# EAGLE design gr10-1 (EAGLE 6.1)
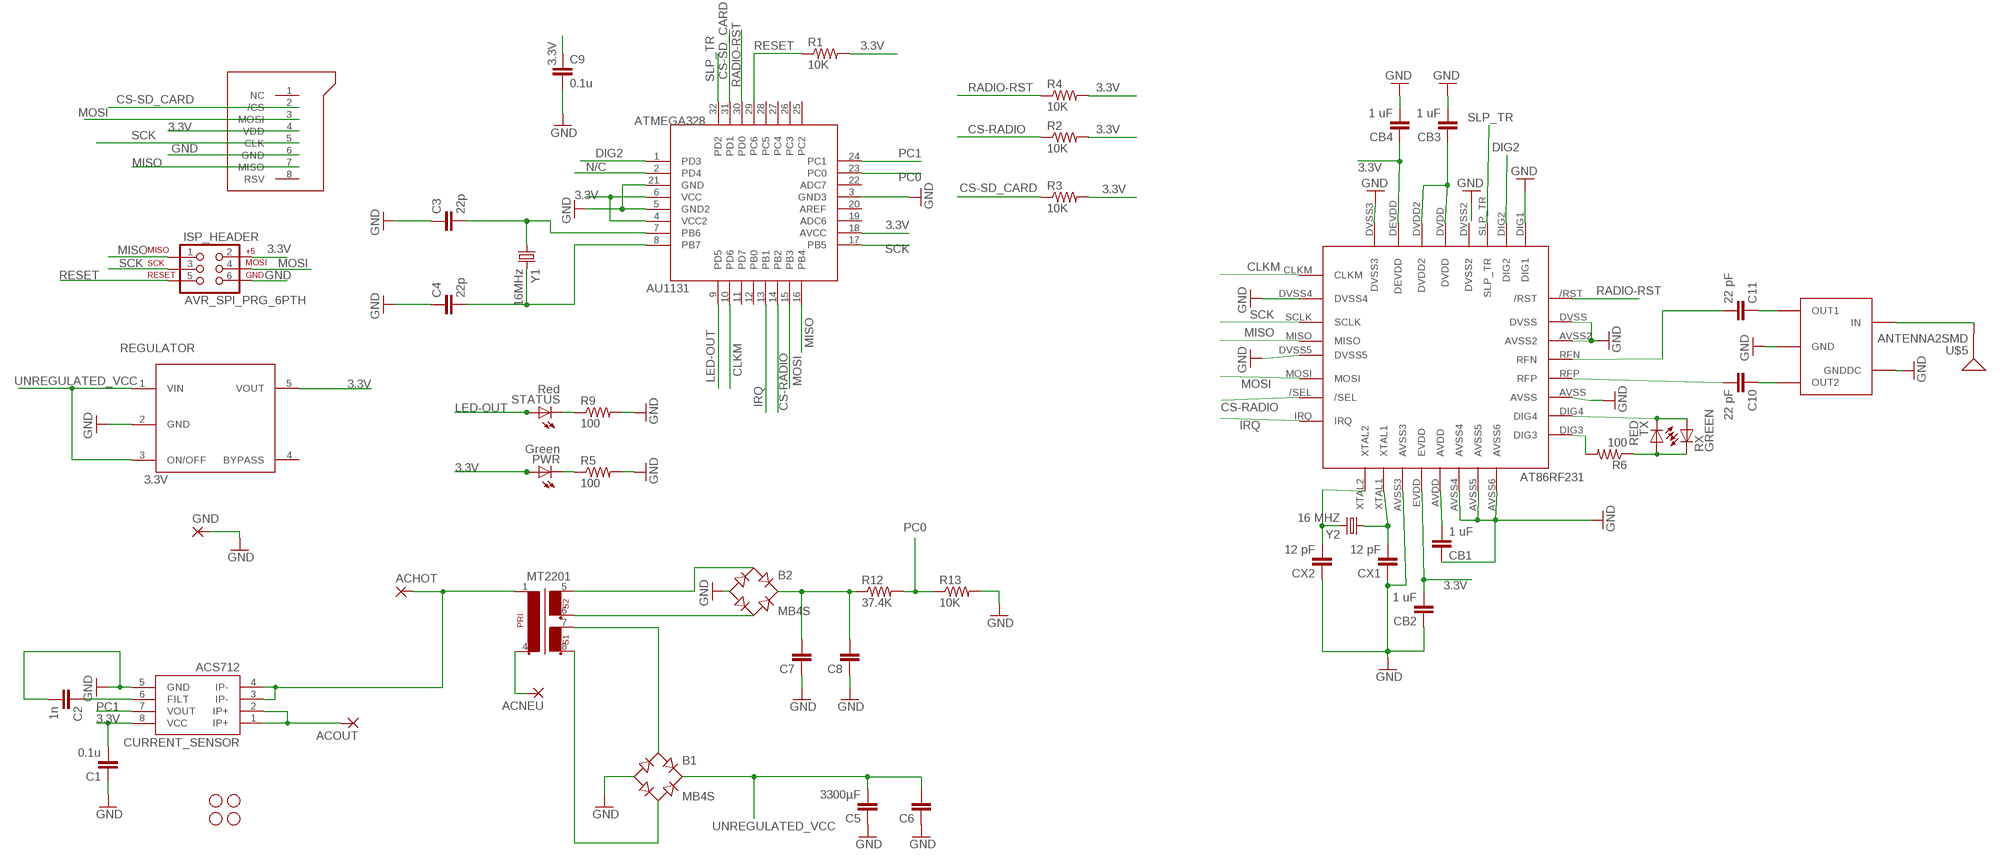
[diagram p0: schematic, sheet 1]

## Parts
3.3V_REGULATOR  REG3.3V  [SOT23-5]
ACHOT  3,81/1,4  [3,81/1,4]
ACNEU  3,81/1,4  [3,81/1,4]
ACOUT  3,81/1,4  [3,81/1,4]
B1  MB4S  [SOIC-4]
B2  MB4S  [SOIC-4]
C1  0.1u  CAP0603-CAP  [0603-CAP]
C2  1n  CAP0603-CAP  [0603-CAP]
C3  22p  CAP0603-CAP  [0603-CAP]
C4  22p  CAP0603-CAP  [0603-CAP]
C5  3300µF  CAPPTH1  [CAP-PTH-5MM]
C6  CAPPTH1  [CAP-PTH-5MM]
C7  CAPPTH1  [CAP-PTH-5MM]
C8  CAPPTH1  [CAP-PTH-5MM]
C9  0.1u  CAP0603-CAP  [0603-CAP]
C10  22 pF  CAP0603-CAP  [0603-CAP]
C11  22 pF  CAP0603-CAP  [0603-CAP]
CB1  1 uF  CAP0603-CAP  [0603-CAP]
CB2  1 uF  CAP0603-CAP  [0603-CAP]
CB3  1 uF  CAP0603-CAP  [0603-CAP]
CB4  1 uF  CAP0603-CAP  [0603-CAP]
CURRENT_SENSOR  ACS712  [SO08]
CX1  12 pF  CAP0603-CAP  [0603-CAP]
CX2  12 pF  CAP0603-CAP  [0603-CAP]
GND  3,81/1,4  [3,81/1,4]
ISP_HEADER  AVR_SPI_PRG_6PTH  [2X3]
JP1  STAND-OFF  [STAND-OFF]
JP2  STAND-OFF  [STAND-OFF]
JP3  STAND-OFF  [STAND-OFF]
JP4  STAND-OFF  [STAND-OFF]
MT2201  EI38-2  [EI38-2]
PWR  Green  LED0603  [LED-0603]
R1  10K  RESISTOR0603-RES  [0603-RES]
R2  10K  RESISTOR0603-RES  [0603-RES]
R3  10K  RESISTOR0603-RES  [0603-RES]
R4  10K  RESISTOR0603-RES  [0603-RES]
R5  100  RESISTOR0603-RES  [0603-RES]
R6  100  RESISTOR0603-RES  [0603-RES]
R9  100  RESISTOR0603-RES  [0603-RES]
R12  37.4K  RESISTOR0603-RES  [0603-RES]
R13  10K  RESISTOR0603-RES  [0603-RES]
RX  GREEN  LED0603  [LED-0603]
STATUS  Red  LED0603  [LED-0603]
TX  RED  LED0603  [LED-0603]
U$1  MICROSD  [MICRO-SD-SOCKET-PP]
U$2  ATMEGA32832A  [TQFP32-08]
U$3  AT86RF231(RADIO)AT86RF231  [32QN2(RADIO)]
U$4  WE-BAL  [WE-BAL]
U$5  ANTENNA2SMD  [ANTENNA-CHIP2]
Y1  16MHz  CRYSTALSMD  [HC49UP]
Y2  16 MHZ  CRYSTALSMD  [HC49UP]

## Nets
3.3V: 3.3V_REGULATOR.5(VOUT) C1.2 C9.1 CB2.2 CB4.1 CURRENT_SENSOR.8(VCC) ISP_HEADER.2 PWR.A R1.2 R2.2 R3.2 R4.2 U$1.4(VDD) U$2.4(VCC2) U$2.6(VCC) U$2.18(AVCC) U$3.DEVDD U$3.EVDD
CLKM: U$2.10(PD6) U$3.CLKM
CS-RADIO: R2.1 U$2.14(PB2) U$3./SEL
CS-SD_CARD: R3.1 U$1.2(/CS) U$2.31(PD1)
DIG2: U$2.1(PD3) U$3.DIG2
GND: 3.3V_REGULATOR.2(GND) B1.- B2.- C1.1 C2.2 C3.1 C4.1 C5.1 C6.1 C7.1 C8.1 C9.2 CB1.1 CB2.1 CB3.2 CB4.2 CURRENT_SENSOR.5(GND) CX1.1 CX2.1 GND.1(P) ISP_HEADER.6 R5.2 R9.2 R13.2 U$1.6(GND) U$2.3(GND3) U$2.5(GND2) U$2.21(GND) U$3.AVSS U$3.AVSS2 U$3.AVSS3 U$3.AVSS4 U$3.AVSS5 U$3.AVSS6 U$3.DIG1 U$3.DVSS U$3.DVSS3 U$3.DVSS4 U$3.DVSS5 U$4.GND U$4.GNDDC
IRQ: U$2.13(PB1) U$3.IRQ
LED-OUT: STATUS.A U$2.9(PD5)
MISO: ISP_HEADER.1 U$1.7(MISO) U$2.16(PB4) U$3.MISO
MOSI: ISP_HEADER.4 U$1.3(MOSI) U$2.15(PB3) U$3.MOSI
N$1: ACHOT.1(P) CURRENT_SENSOR.3(IP-) CURRENT_SENSOR.4(IP-) MT2201.1
N$2: ACNEU.1(P) MT2201.4
N$3: B1.~2(AC2) MT2201.8
N$4: B2.~1(AC1) MT2201.5
N$5: B2.~2(AC2) MT2201.6
N$6: B2.+ C7.2 C8.2 R12.1
N$7: PWR.C R5.1
N$8: ACOUT.1(P) CURRENT_SENSOR.1(IP+) CURRENT_SENSOR.2(IP+)
N$9: CB3.1 U$3.DVDD U$3.DVDD2
N$10: CB1.2 U$3.AVDD
N$11: CX1.2 U$3.XTAL1 Y2.1
N$12: CX2.2 U$3.XTAL2 Y2.2
N$13: RX.A TX.C U$3.DIG4
N$14: R6.1 RX.C TX.A
N$15: R6.2 U$3.DIG3
N$16: C10.1 U$4.OUT2
N$17: C11.1 U$4.OUT1
N$18: C11.2 U$3.RFN
N$19: C10.2 U$3.RFP
N$20: U$4.IN U$5.FEED(SIGNAL)
N$23: B1.~1(AC1) MT2201.7
N$28: C2.1 CURRENT_SENSOR.6(FILT)
N$30: R9.1 STATUS.C
N/C: U$2.2(PD4)
PC0: R12.2 R13.1 U$2.23(PC0)
PC1: CURRENT_SENSOR.7(VOUT) U$2.24(PC1)
RADIO-RST: R4.1 U$2.30(PD0) U$3./RST
RESET: ISP_HEADER.5 R1.1 U$2.29(PC6)
SCK: ISP_HEADER.3 U$1.5(CLK) U$2.17(PB5) U$3.SCLK
SLP_TR: U$2.32(PD2) U$3.SLP_TR
UNREGULATED_VCC: 3.3V_REGULATOR.1(VIN) 3.3V_REGULATOR.3(ON/OFF) B1.+ C5.2 C6.2
XTAL1: C3.2 U$2.7(PB6) Y1.1
XTAL2: C4.2 U$2.8(PB7) Y1.2
Unconnected: 3.3V_REGULATOR.4(BYPASS) U$1.1(NC) U$1.8(RSV) U$2.11(PD7) U$2.12(PB0) U$2.19(ADC6) U$2.20(AREF) U$2.22(ADC7) U$2.25(PC2) U$2.26(PC3) U$2.27(PC4) U$2.28(PC5) U$3.DVSS2

## Library data of the parts
3.3V_REGULATOR = group10:REG3.3V
ACHOT ACNEU ACOUT GND = wirepad:3,81/1,4: THROUGH-HOLE PAD
B1 B2 = rectifier:MB*S: Bridge Rectifier Source: http://www.fairchildsemi.com/ds/MB/MB6S.pdf
C1-C11 CB1-CB4 CX1 CX2 = SparkFun:CAP: Capacitor Standard 0603 ceramic capacitor, and 0.1" leaded capacitor.
CURRENT_SENSOR = group10:ACS712
ISP_HEADER = SparkFun:AVR_SPI_PRG_6: AVR ISP 6 Pin This is the reduced ISP connector for AVR programming. Common on Arduino. This footprint will take up less PCB space and can be used with a 10-pin to 6-pin adapter such as SKU: BOB-08508
JP1-JP4 = SparkFun:STAND-OFF: Stand Off This is the mechanical footprint for a #4 phillips button head screw. Use the keepout ring to avoid running the screw head into surrounding components. SKU : PRT-00447
MT2201 = group10:EI38-2: TRANSFORMER 1 primary winding, 2 secondary windings ERA
PWR RX STATUS TX = SparkFun:LED: LEDs Standard schematic elements and footprints for 5mm, 3mm, 1206, and 0603 sized LEDs. 5mm - Spark Fun Electronics SKU : COM-00529 (and others)
R1-R6 R9 R12 R13 = SparkFun:RESISTOR: Resistor Basic schematic elements and footprints for 0603, 1206, and PTH resistors.
U$1 = group10:MICROSD
U$2 = group10:ATMEGA328
U$3 = group10:AT86RF231(RADIO)
U$4 = group10:WE-BAL
U$5 = SparkFun:ANTENNA2: Antenna Single endded antenna. Common with smaller chip antennas. CHIP4 package is the GPS Chip Antenna SKU: GPS-08418. CHIP5 package is 2.4GHz chip antenna SKU: WRL-00144.
Y1 Y2 = group10:CRYSTAL: Crystals Various standard crystals. Proven footprints. Spark Fun Electronics SKU : COM-00534

## Net classes
1 Mini: width 0.25 mm

## Board
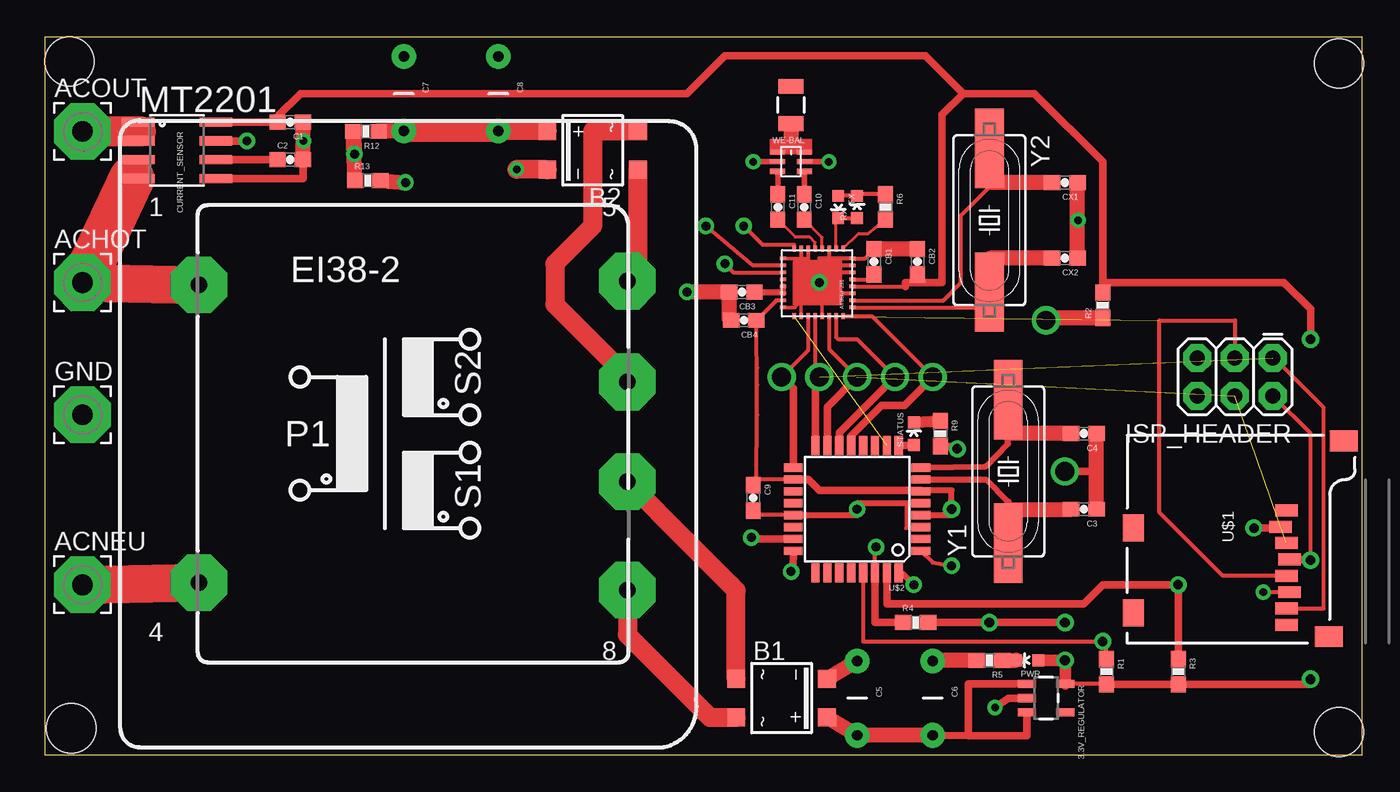
[diagram p1: board, top side]
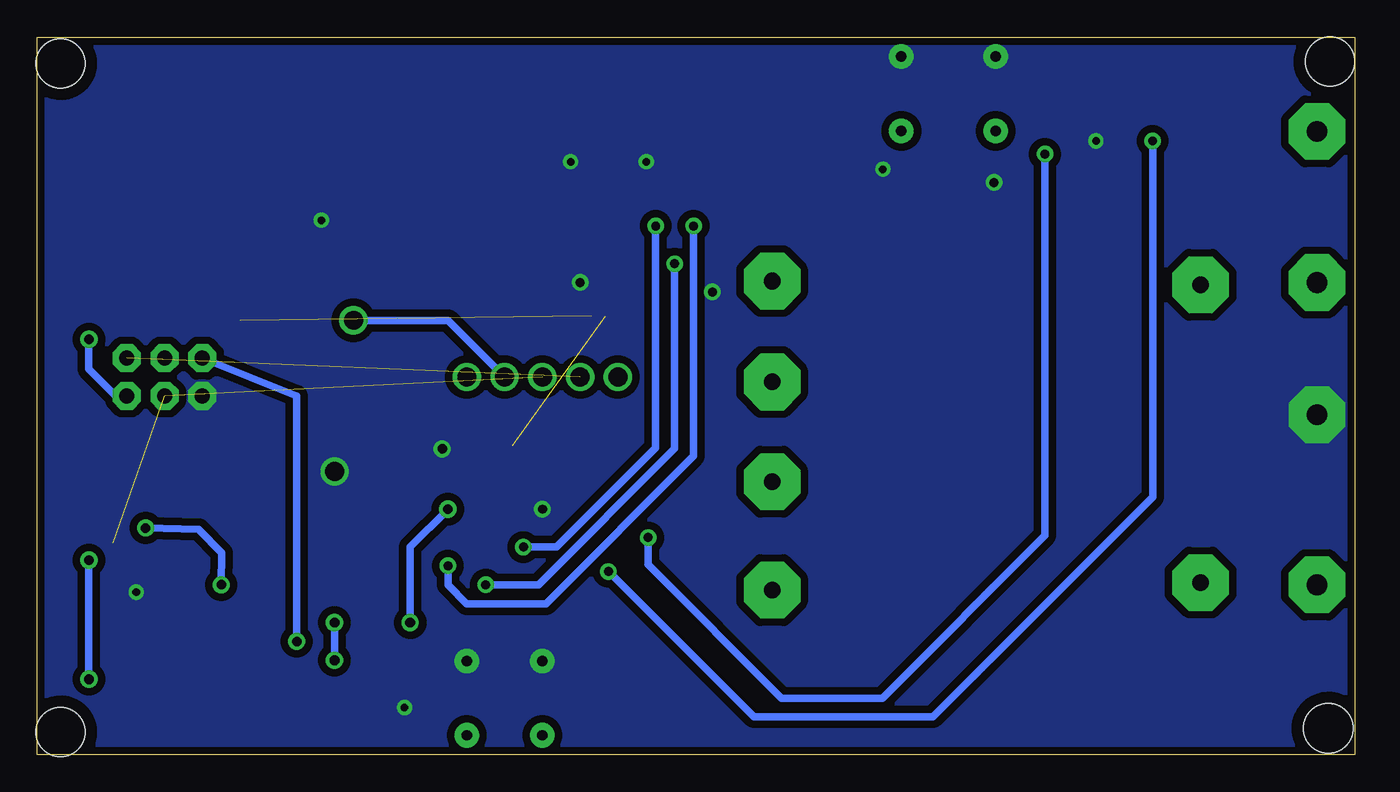
[diagram p2: board, bottom side, seen from below]

Size 88.57 x 48.25 mm. Coordinates in mm from the lower left corner, seen from the top.
Outline: 0,0 88.57,0 88.57,48.25 0,48.25 0,0
Copper layers (1*16): Top 0.035mm / dielectric 1.5mm / Bottom 0.035mm
Design rules: minimum track width 8mil, minimum drill 20mil, track to track 15mil, track to pad 15mil, pad to pad 15mil, via to via 15mil, smd to smd 0mil, copper to edge 10mil, drill to drill 8mil, minimum pad ring 12mil, minimum via ring 10mil, stop-mask expansion 4mil, vias tented up to drill 25mil, thermal gap 10mil

### Footprints (pad centres in the part's own frame; a part is rotated, then mirrored left to right if it is on the bottom)
SOT23-5 = smd 0.55 x 1.2: 1 -0.95,-1.3; 2 0,-1.3; 3 0.95,-1.3; 4 0.95,1.3; 5 -0.95,1.3
3,81/1,4 = drill 1.397 pad 3.81 octagon: 1 0,0
SOIC-4 = smd 1.2 x 1.2: + 1.3,3.05; - -1.3,3.05; ~1 -1.3,-3.05; ~2 1.3,-3.05
0603-CAP = smd 1.1 x 1: 1 -0.85,0; 2 0.85,0
CAP-PTH-5MM = drill 0.7 pad 1.651: 1 -2.5,0; 2 2.5,0
SO08 = smd 0.61 x 2.21: 1 -1.905,-2.616; 2 -0.635,-2.616; 3 0.635,-2.616; 4 1.905,-2.616; 5 1.905,2.616; 6 0.635,2.616; 7 -0.635,2.616; 8 -1.905,2.616
2X3 = drill 1.016 pad 1.88 octagon: 1 0,0; 2 0,2.54; 3 2.54,0; 4 2.54,2.54; 5 5.08,0; 6 5.08,2.54
STAND-OFF = hole 3.302: 0,0
EI38-2 = drill 1.118 pad 3.81 octagon: 1 -12.497,10.008; 4 -12.497,-10.008; 5 16.307,10.262; 6 16.307,3.48; 7 16.307,-3.226; 8 16.307,-10.516
LED-0603 = smd 0.8 x 0.8: A 0,-0.75; C 0,0.75
0603-RES = smd 1.1 x 1: 1 -0.85,0; 2 0.85,0
MICRO-SD-SOCKET-PP = smd 0.8 x 1.5: 1 -8.94,10.7; 2 -7.84,10.3; 3 -6.74,10.7; 4 -5.64,10.9; 5 -4.54,10.7; 6 -3.44,10.9; 7 -2.34,10.7; 8 -1.24,10.7 | smd 1.8 x 1.4: CD1 -2.05,0.4; CD2 -7.75,0.4 | smd 1.4 x 1.9: GND1 -13.6,14.55; GND3 -0.45,13.55
TQFP32-08 = smd 1.27 x 0.559: 1 -4.293,2.8; 2 -4.293,2; 3 -4.293,1.2; 4 -4.293,0.4; 5 -4.293,-0.4; 6 -4.293,-1.2; 7 -4.293,-2; 8 -4.293,-2.8; 17 4.293,-2.8; 18 4.293,-2; 19 4.293,-1.2; 20 4.293,-0.4; 21 4.293,0.4; 22 4.293,1.2; 23 4.293,2; 24 4.293,2.8 | smd 0.559 x 1.27: 9 -2.8,-4.293; 10 -2,-4.293; 11 -1.2,-4.293; 12 -0.4,-4.293; 13 0.4,-4.293; 14 1.2,-4.293; 15 2,-4.293; 16 2.8,-4.293; 25 2.8,4.293; 26 2,4.293; 27 1.2,4.293; 28 0.4,4.293; 29 -0.4,4.293; 30 -1.2,4.293; 31 -2,4.293; 32 -2.8,4.293
32QN2(RADIO) = smd 0.4 x 0.23: /RST -2.29,-1.7; /SEL 2.26,1.13; AVSS -2.29,0.65; AVSS2 -2.29,-0.76; CLKM 2.26,-1.69; DIG3 -2.29,1.59; DIG4 -2.29,1.12; DVSS -2.29,-1.23; DVSS4 2.26,-1.22; DVSS5 2.26,0.19; IRQ 2.26,1.6; MISO 2.26,-0.28; MOSI 2.26,0.66; RFN -2.29,-0.29; RFP -2.29,0.18; SCLK 2.26,-0.75 | smd 0.23 x 0.4: AVDD -0.21,2.23; AVSS3 0.73,2.23; AVSS4 -0.68,2.23; AVSS5 -1.15,2.23; AVSS6 -1.62,2.23; DEVDD 1.2,-2.44; DIG1 -1.62,-2.44; DIG2 -1.15,-2.44; DVDD 0.26,-2.44; DVDD2 0.73,-2.44; DVSS2 -0.21,-2.44; DVSS3 1.67,-2.44; EVDD 0.26,2.23; SLP_TR -0.68,-2.44; XTAL1 1.2,2.23; XTAL2 1.67,2.23
WE-BAL = smd 1 x 0.35: GND 0.9,0; GNDDC -0.9,0; IN -0.9,0.65; NC 0.9,0.65; OUT1 -0.9,-0.65; OUT2 0.9,-0.65
ANTENNA-CHIP2 = smd 1.7 x 1: FEED 0,1.25; P$2 0,-1.25
HC49UP = smd 5.334 x 1.93: 1 -4.826,0; 2 4.826,0

### Placement (x,y rotation side)
3.3V_REGULATOR  67.31,3.81 270 top
ACHOT  2.54,31.75 0 top
ACNEU  2.54,11.43 0 top
ACOUT  2.54,41.91 0 top
B1  49.53,3.81 270 top
B2  36.83,40.64 90 top
C1  16.51,42.55 180 top
C2  16.51,40.01 0 top
C3  69.85,16.51 180 top
C4  69.85,21.59 180 top
C5  54.61,3.81 270 top
C6  59.69,3.81 270 top
C7  24.13,44.45 270 top
C8  30.48,44.45 270 top
C9  47.62,17.27 270 top
C10  51.05,36.83 270 top
C11  49.28,36.83 270 top
CB1  55.75,33.15 270 top
CB2  58.67,33.15 270 top
CB3  46.86,31.11 180 top
CB4  46.99,29.21 180 top
CURRENT_SENSOR  8.89,40.64 270 top
CX1  68.58,38.48 180 top
CX2  68.58,33.4 180 top
GND  2.54,22.86 0 top
ISP_HEADER  82.55,26.67 180 top
JP1  1.78,1.78 0 top
JP2  87,46.48 0 top
JP3  1.65,46.61 0 top
JP4  87,1.52 0 top
MT2201  22.86,21.59 0 top
PWR  66.04,6.35 90 top
R1  71.37,5.59 270 top
R2  71.12,30.23 90 top
R3  76.2,5.59 270 top
R4  58.55,8.89 0 top
R5  63.5,6.35 180 top
R6  56.52,36.83 270 top
R9  60.2,21.59 270 top
R12  21.59,41.91 180 top
R13  21.72,38.61 0 top
RX  54.61,36.83 0 top
STATUS  58.42,21.59 0 top
TX  53.34,36.83 180 top
U$1  72.77,7.49 270 top
U$2  54.61,16.51 180 top
U$3  52.07,31.75 270 top
U$4  50.16,39.88 0 top
U$5  50.16,43.69 180 top
Y1  64.77,19.05 90 top
Y2  63.5,35.94 270 top

### Tracks (layer width: path | path; a pad name or v marks a point on that pad's centre or on a via)
3.3V  (via drill 0.66)
  Top 0.254: v85.09,13.08 85.09,21.59 ISP_HEADER.2 | U$3.DEVDD 49.18,30.55 CB4.1 47.84,27.52 47.88,26.04 47.88,24.89 47.88,22.86 47.84,18.51 47.24,18.51 | U$3.EVDD 57.87,31.49 CB2.2 | U$2.18 47.24,18.51 | 47.24,18.51 C9.1 | R1.2 71.37,4.76 3.3V_REGULATOR.5
  Top 0.406: U$2.4 60.96,16.11 v60.96,16.51 60.96,17.78 58.9,17.78 U$2.6
  Top 0.508: CURRENT_SENSOR.8 C1.2 15.66,42.92 17.19,44.45 43.18,44.45 45.72,46.99 57.15,46.99 59.2,46.99 61.74,44.45 | R1.2 R3.2 85.09,4.74 v85.09,5.08 | 57.87,31.49 57.87,31.75 60.33,31.75 60.33,43.03 61.74,44.45 | 61.74,44.45 66.54,44.45 71.12,39.87 71.12,31.88 | 71.12,31.88 71.12,31.75 | 71.12,31.75 71.12,31.88 | 71.12,31.88 R2.2 | R4.2 62.23,8.89 v63.5,8.89 v68.58,8.89 | U$1.4 85.09,13.13 v85.09,13.08 | 58.9,17.78 52.07,17.78 51.34,18.51 U$2.18 | 71.12,31.75 83.29,31.75 85.09,29.95 v85.09,27.94
  Top 0.762: 3.3V_REGULATOR.5 68.61,6.35 v68.58,6.35 PWR.A
  Bottom 0.508: v68.58,6.35 v68.58,8.89 | v85.09,5.08 v85.09,13.08 | v60.96,16.51 63.5,13.97 v63.5,8.89 | v85.09,27.94 85.09,25.93 83.29,24.13 ISP_HEADER.2
CLKM  (1 unrouted)
CS-RADIO  (via drill 1.27)
  Top 0.254: U$3./SEL 53.2,28.08 53.34,27.94 54.61,27.94 v57.15,25.4
  Top 0.508: U$2.14 53.41,21.66 v57.15,25.4
  Top 1.016: R2.1 67.48,29.38 v67.31,29.21
  Bottom 0.508: v67.31,29.21 60.96,29.21 v57.15,25.4
CS-SD_CARD  (via drill 0.64)
  Top 0.508: U$2.31 56.61,10.16 69.85,10.16 71.12,11.43 v76.2,11.43 R3.1 | U$1.2 83.07,15.24 82.55,15.24 v81.28,15.24
  Bottom 0.508: v76.2,11.43 76.15,13.59 77.72,15.16 v81.28,15.24
DIG2  (via drill 0.6)
  Top 0.254: U$2.1 59.69,12.92 v60.96,12.7 | U$3.DIG2 47.62,32.9 v44.45,35.56
  Bottom 0.508: v60.96,12.7 60.96,11.43 59.69,10.16 54.37,10.16 44.45,20.08 v44.45,35.56
GND  (via drill 0.51, 0.6, 0.64, 1.27)
  Top 0.2: CX1.1 69.47,38.44 v69.47,35.94
  Top 0.25: U$3.DVSS5 52.27,31.67 52.27,31.75 v52.07,31.75 | U$3.DIG1 51.21,33.37 51.21,33.35 v52.07,31.75 | U$3.DVSS4 50.85,29.54 50.85,30.53 | U$3.DVSS3 50.42,30.08 50.42,30.1 50.85,30.53 | 50.85,30.53 v52.07,31.75
  Top 0.254: C4.1 70.61,21.59 | U$4.GNDDC 48.9,39.88 | U$1.6 v81.92,10.93 | CB1.1 55.13,33.37 U$3.AVSS6 52.07,33.37 v52.07,31.75 | U$2.21 47.24,16.11 C9.2 | U$3.DVSS 50.84,31.75 v52.07,31.75 | U$3.AVSS2 51.31,31.75 v52.07,31.75 | U$3.AVSS 52.72,31.75 v52.07,31.75 | U$3.AVSS5 52.07,32.9 v52.07,31.75 | U$3.AVSS4 52.07,32.43 v52.07,31.75 | U$3.AVSS3 52.07,31.02 v52.07,31.75 | U$2.5 57.91,16.91 57.91,15.24 58.42,15.24 58.42,15.31 U$2.3 | C6.1 59.73,6.31 59.73,6.35 | C1.1 17.4,42.55 v17.4,41.27
  Top 0.356: 48.9,39.88 v47.62,39.88 | U$4.GND v52.7,39.88
  Top 0.406: U$2.21 54.61,16.11 v54.61,16.51 54.61,16.91 U$2.5 | C3.1 70.74,16.55
  Top 0.508: CURRENT_SENSOR.5 17.36,38.73 C2.2 | 3.3V_REGULATOR.2 64.77,3.81 v63.88,3.17 | v61.34,20.57 61.17,20.74 R9.2 | 70.61,21.59 70.74,21.46 70.74,19.05 70.61,19.05 v68.58,19.05
  Top 1: CB3.2 v43.18,31.11
  Top 1.016: R5.2 59.73,6.35 | C3.1 C4.1 | C2.2 C1.1 | B1.- C5.1 | CX2.1 CX1.1 | CB3.2 46.01,29.34 CB4.2 | CB2.1 CB1.1 | R13.2 v24.26,38.48
  Top 1.27: B2.- v31.72,39.37
  pour Bottom (isolate 0.508, no thermals): 88.9,48.26 0,48.26 0,0 88.9,0
IRQ  (via drill 1.27)
  Top 0.254: U$3.IRQ 55.6,29.49 v59.69,25.4
  Top 0.508: U$2.13 54.21,21.44 56.26,23.5 57.78,23.5 v59.69,25.4
LED-OUT
  Top 0.508: STATUS.A 58.38,20.8 U$2.9
MISO  (via drill 1.27)  (1 unrouted)
  Top 0.254: U$1.7 85.98,9.83 85.98,23.34 82.64,26.67 ISP_HEADER.1 | U$3.MISO 51.79,25.68 v52.07,25.4
  Top 0.508: U$2.16 51.81,25.14 v52.07,25.4
MOSI  (via drill 1.27)  (2 unrouted)
  Top 0.254: U$3.MOSI 52.73,27.28 v54.61,25.4
  Top 0.508: U$2.15 52.61,23.4 v54.61,25.4
N$1
  Top 0.254: 5.84,38.73 CURRENT_SENSOR.4 CURRENT_SENSOR.3
  Top 2.54: ACHOT.1 MT2201.1
  Top 3.048: 5.84,38.73 ACHOT.1
N$2
  Top 2.54: ACNEU.1 MT2201.4
N$3
  Top 1.27: MT2201.8 39.17,8.06 44.72,2.51 B1.~2
N$4
  Top 1.27: MT2201.5 39.88,31.85 B2.~1
N$5
  Top 1.27: 39.17,25.4 MT2201.6 39.17,25.4 | B2.~2 36.83,41.94 36.83,35.56 34.29,33.02 34.29,30.28 39.17,25.4
N$6
  Top 1.016: R12.1 22.44,41.95 C7.2
  Top 1.27: B2.+ C8.2
  Top 1.524: C8.2 C7.2
N$7
  Top 1.016: R5.1 PWR.C
N$8
  Top 0.254: 6.48,41.91 CURRENT_SENSOR.1 CURRENT_SENSOR.2
  Top 2.032: 6.48,41.91 ACOUT.1
N$9
  Top 0.406: U$3.DVDD U$3.DVDD2 49.53,31.11 CB3.1
N$10
  Top 0.254: U$3.AVDD 55.42,31.96 CB1.2
N$11
  Top 0.254: Y2.1 63.5,38.48 63.5,38.17 61.59,36.27 61.59,31.75 60.4,30.55 U$3.XTAL1
  Top 1.016: CX1.2 63.5,38.48 63.5,39.37 Y2.1
N$12
  Top 0.254: U$3.XTAL2 63.5,30.08 63.65,30.08
  Top 0.508: Y2.2 63.5,30.08
  Top 1.016: CX2.2 63.56,33.4 Y2.2
N$13
  Top 0.2: U$3.DIG4 53.19,35.93
  Top 0.254: TX.C RX.A
  Top 0.406: 53.19,35.93 TX.C
N$14
  Top 0.254: TX.A RX.C 54.71,37.68 R6.1
N$15
  Top 0.2: U$3.DIG3 54.7,35.05 55.37,35.05 R6.2
N$16
  Top 0.254: 51.05,39.22 U$4.OUT2
  Top 0.381: C10.1 51.05,39.22
N$17
  Top 0.254: 49.28,39.22 U$4.OUT1
  Top 0.381: C11.1 49.28,39.22
N$18
  Top 0.2: U$3.RFN 51.78,34.45 51.44,34.8 50.46,34.8 C11.2
N$19
  Top 0.2: U$3.RFP 52.25,34.78 C10.2
N$20
  Top 0.254: 50.16,41.43 U$4.IN
  Top 1.016: U$5.FEED 50.16,41.43
N$23
  Top 1.27: B1.~1 46.48,11.05 46.1,11.43 43.18,14.35 MT2201.7
N$28
  Top 0.508: C2.1 CURRENT_SENSOR.6
N$30
  Top 0.762: R9.1 STATUS.C
PC0  (via drill 0.6)
  Top 0.508: U$2.23 47.5,14.51 v47.5,14.61
  Top 1.016: R13.1 R12.2 v20.83,40.39
  Bottom 0.508: v47.5,14.61 47.5,12.79 38.52,3.81 31.75,3.81 20.83,14.73 v20.83,40.39
PC1  (via drill 0.6)
  Top 0.254: 50.16,12.44 v50.16,12.32
  Top 0.508: CURRENT_SENSOR.7 v13.59,41.27 | U$2.24 50.29,12.45 50.16,12.45 50.16,12.44
  Bottom 0.508: v50.16,12.32 40.39,2.54 35.56,2.54 28.37,2.54 13.59,17.32 v13.59,41.27
RADIO-RST  (via drill 0.6)
  Top 0.254: U$2.30 55.81,13.97 v55.88,13.97 | v46.99,35.56 48.26,34.29 50.37,34.29 U$3./RST
  Top 0.508: U$2.30 55.81,9.53 55.81,8.89 R4.1
  Bottom 0.508: v55.88,13.97 53.65,13.97 46.99,20.63 46.99,25.4 v46.99,35.56
RESET  (via drill 0.64)
  Top 0.254: U$2.29 55.01,7.64 55.03,7.62 v71.12,7.62 71.37,7.62 R1.1
  Bottom 0.508: v71.12,7.62 71.12,24.13 ISP_HEADER.5
SCK  (via drill 1.27)  (1 unrouted)
  Top 0.254: U$1.5 79.2,12.03 74.93,16.31 74.93,29.21 80.01,29.21 ISP_HEADER.3 | U$3.SCLK 51.32,27.19 v49.53,25.4
  Top 0.508: U$2.17 50.32,24.61 v49.53,25.4
SLP_TR  (via drill 0.6)
  Top 0.254: v45.72,33.02 46.31,32.43 U$3.SLP_TR
  Top 0.381: U$2.32 57.63,12.22 v58.42,11.43
  Bottom 0.508: v58.42,11.43 54.88,11.43 45.72,20.59 v45.72,33.02
UNREGULATED_VCC
  Top 0.508: 3.3V_REGULATOR.3 66.01,1.27 62.1,1.27 | 3.3V_REGULATOR.1 62.1,4.76 62.1,1.27 | C6.2 62.1,1.27
  Top 1.016: C6.2 C5.2 B1.+
XTAL1
  Top 0.406: U$2.7 63.3,18.51 64.79,17.01 Y1.1
  Top 1.016: Y1.1 64.77,16.51 C3.2
XTAL2
  Top 0.406: U$2.8 63.26,19.4 64.75,20.91 Y1.2
  Top 1.016: C4.2 64.77,21.59 64.77,22.86 Y1.2
(copper drawn outside any net)
  shapes: Top area x2